# Altium schematic sheet TopLevel.SchDoc: Top Level Hierarchy
size 279 x 215 mm; DrawnBy: Connor Dack; DocumentNumber: 3; Revision: 1.0; SheetNumber: 3; SheetTotal: 20
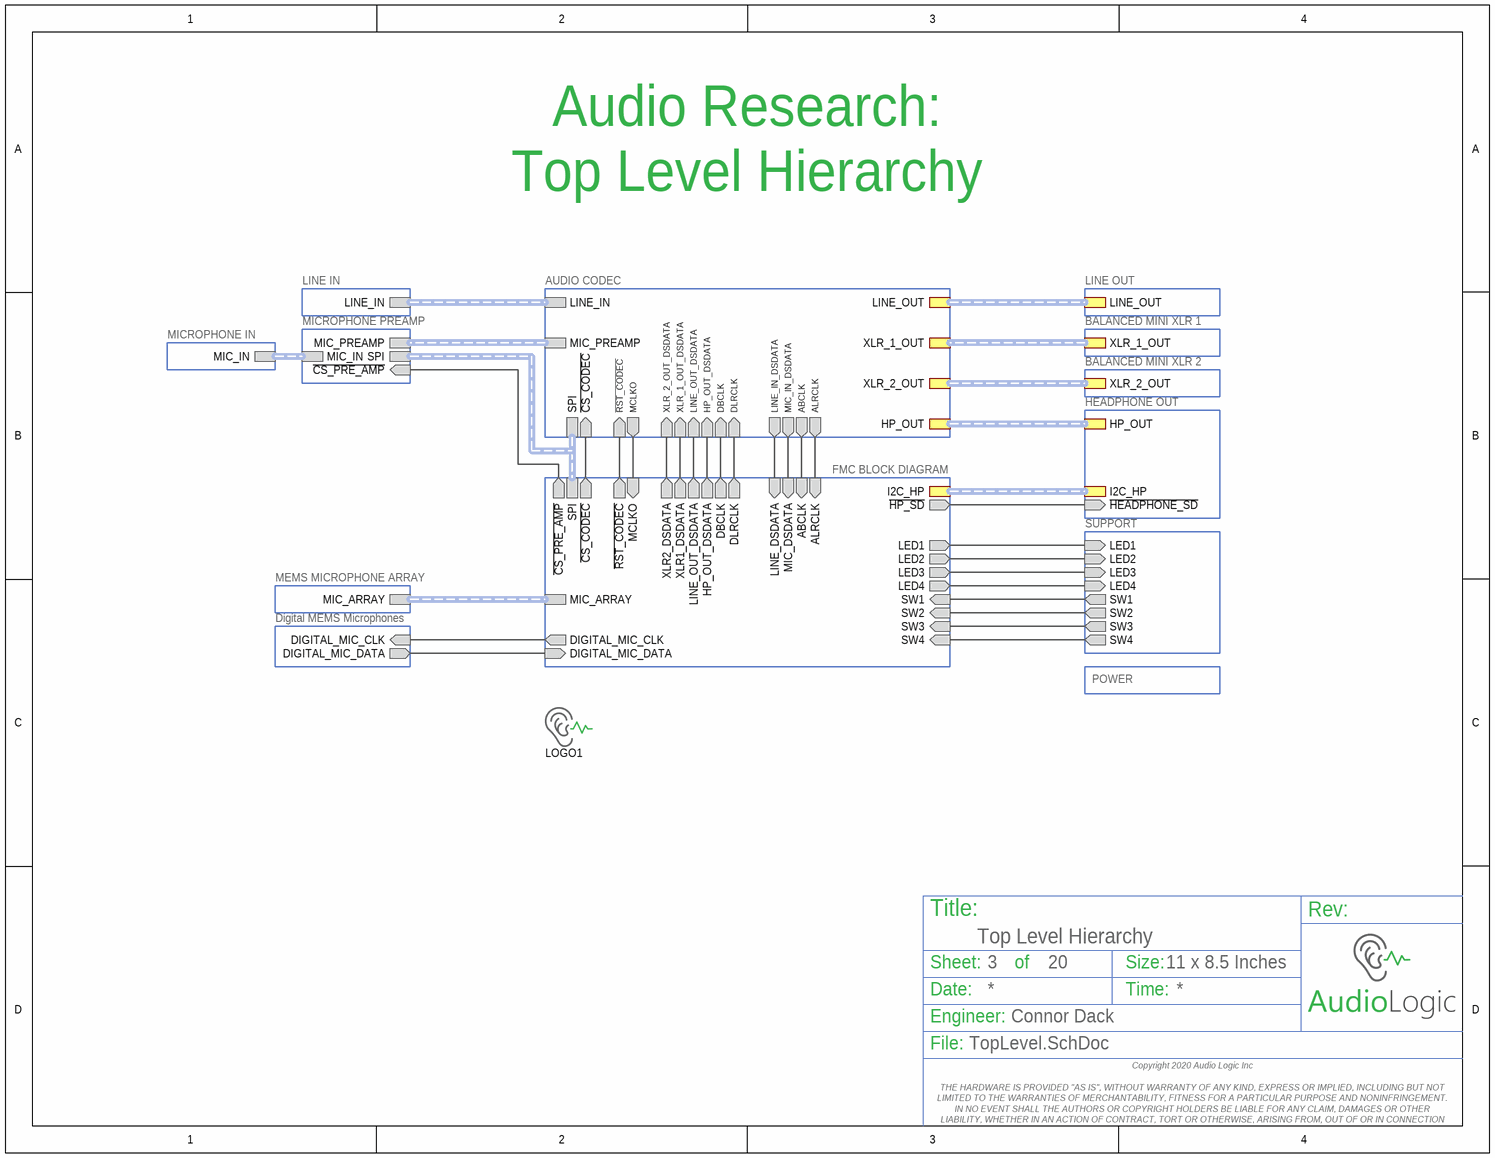
[diagram p0: TopLevel.SchDoc]

## Parts
LOGO1  Audio Logic Logo  [AL_Logo_Small_Silkscreen]  (value not drawn)  (no BOM)

## Sub-sheets
AUDIO CODEC = Audio_Codec.SchDoc: MIC_IN_DSDATA (out), ABCLK (out), ALRCLK (out), DBCLK (in), DLRCLK (in), MCLKO (out), ~{RST_CODEC} (in), HP_OUT_DSDATA (in), LINE_IN (harness LINE_IN), HP_OUT (harness HP_OUT), XLR_1_OUT_DSDATA (in), LINE_IN_DSDATA (out), LINE_OUT_DSDATA (in), XLR_2_OUT_DSDATA (in), LINE_OUT (harness LINE_OUT), MIC_PREAMP (harness MIC_PREAMP), XLR_1_OUT (harness XLR_1_OUT), SPI (harness SPI), ~{CS_CODEC} (in), XLR_2_OUT (harness XLR_2_OUT)
BALANCED MINI XLR 1 = Audio_Output_XLR1.SchDoc: XLR_1_OUT (harness MIC_IN)
BALANCED MINI XLR 2 = Audio_Output_XLR2.SchDoc: XLR_2_OUT (harness XLR_2_OUT)
Digital MEMS Microphones = Audio_Input_Digitial_Mic.SchDoc: DIGITAL_MIC_CLK (in), DIGITAL_MIC_DATA (out)
FMC BLOCK DIAGRAM = FMC_Block_Diagram.SchDoc: DIGITAL_MIC_CLK (out), DIGITAL_MIC_DATA (in), MIC_ARRAY (harness Microphone Array), LED1 (out), LED2 (out), LED3 (out), LED4 (out), SW1 (in), SW2 (in), SW3 (in), SW4 (in), ~{HP_SD} (out), ~{CS_PRE_AMP} (out), ~{CS_CODEC} (out), ~{RST_CODEC} (out), XLR2_DSDATA (out), DBCLK (out), DLRCLK (out), LINE_DSDATA (in), MIC_DSDATA (in), ABCLK (in), ALRCLK (in), XLR1_DSDATA (out), LINE_OUT_DSDATA (out), HP_OUT_DSDATA (out), SPI (harness SPI), I2C_HP (harness I2C_Headphone), MCLKO (in)
HEADPHONE OUT = Audio_Output_Headphone.SchDoc: HP_OUT (harness HP_OUT), ~{HEADPHONE_SD} (in), I2C_HP (harness I2C_Headphone)
LINE IN = Audio_Input_Line_In.SchDoc: LINE_IN (harness MIC_IN)
LINE OUT = Audio_Output_Line_Out.SchDoc: LINE_OUT (harness MIC_IN)
MEMS MICROPHONE ARRAY = Audio_Input_Mic_Array.SchDoc: MIC_ARRAY (harness Microphone Array)
MICROPHONE IN = Audio_Input_Mic_In.SchDoc: MIC_IN (harness MIC_IN)
MICROPHONE PREAMP = Audio_Input_Mic_Preamp.SchDoc: MIC_PREAMP (harness MIC_PREAMP), SPI (harness SPI), ~{CS_PRE_AMP} (in), MIC_IN (harness MIC_IN)
POWER = Power.SchDoc: no entries
SUPPORT = Support.SchDoc: SW1 (out), SW2 (out), SW3 (out), SW4 (out), LED1 (in), LED2 (in), LED3 (in), LED4 (in)

## Nets
(unnamed): sheet AUDIO CODEC/MIC_IN_DSDATA, sheet FMC BLOCK DIAGRAM/MIC_DSDATA
(unnamed): sheet AUDIO CODEC/ABCLK, sheet FMC BLOCK DIAGRAM/ABCLK
(unnamed): sheet AUDIO CODEC/ALRCLK, sheet FMC BLOCK DIAGRAM/ALRCLK
(unnamed): sheet AUDIO CODEC/DBCLK, sheet FMC BLOCK DIAGRAM/DBCLK
(unnamed): sheet AUDIO CODEC/DLRCLK, sheet FMC BLOCK DIAGRAM/DLRCLK
(unnamed): sheet AUDIO CODEC/MCLKO, sheet FMC BLOCK DIAGRAM/MCLKO
(unnamed): sheet AUDIO CODEC/~{RST_CODEC}, sheet FMC BLOCK DIAGRAM/~{RST_CODEC}
(unnamed): sheet AUDIO CODEC/HP_OUT_DSDATA, sheet FMC BLOCK DIAGRAM/HP_OUT_DSDATA
(unnamed): sheet AUDIO CODEC/XLR_1_OUT_DSDATA, sheet FMC BLOCK DIAGRAM/XLR1_DSDATA
(unnamed): sheet AUDIO CODEC/LINE_IN_DSDATA, sheet FMC BLOCK DIAGRAM/LINE_DSDATA
(unnamed): sheet AUDIO CODEC/LINE_OUT_DSDATA, sheet FMC BLOCK DIAGRAM/LINE_OUT_DSDATA
(unnamed): sheet AUDIO CODEC/XLR_2_OUT_DSDATA, sheet FMC BLOCK DIAGRAM/XLR2_DSDATA
(unnamed): sheet AUDIO CODEC/~{CS_CODEC}, sheet FMC BLOCK DIAGRAM/~{CS_CODEC}
(unnamed): sheet HEADPHONE OUT/~{HEADPHONE_SD}, sheet FMC BLOCK DIAGRAM/~{HP_SD}
(unnamed): sheet SUPPORT/SW1, sheet FMC BLOCK DIAGRAM/SW1
(unnamed): sheet SUPPORT/SW2, sheet FMC BLOCK DIAGRAM/SW2
(unnamed): sheet SUPPORT/SW3, sheet FMC BLOCK DIAGRAM/SW3
(unnamed): sheet SUPPORT/SW4, sheet FMC BLOCK DIAGRAM/SW4
(unnamed): sheet SUPPORT/LED1, sheet FMC BLOCK DIAGRAM/LED1
(unnamed): sheet SUPPORT/LED2, sheet FMC BLOCK DIAGRAM/LED2
(unnamed): sheet SUPPORT/LED3, sheet FMC BLOCK DIAGRAM/LED3
(unnamed): sheet SUPPORT/LED4, sheet FMC BLOCK DIAGRAM/LED4
(unnamed): sheet MICROPHONE PREAMP/~{CS_PRE_AMP}, sheet FMC BLOCK DIAGRAM/~{CS_PRE_AMP}
(unnamed): sheet Digital MEMS Microphones/DIGITAL_MIC_CLK, sheet FMC BLOCK DIAGRAM/DIGITAL_MIC_CLK
(unnamed): sheet Digital MEMS Microphones/DIGITAL_MIC_DATA, sheet FMC BLOCK DIAGRAM/DIGITAL_MIC_DATA

## Buses and harness runs
harness sheet AUDIO CODEC/HP_OUT = sheet HEADPHONE OUT/HP_OUT
harness sheet AUDIO CODEC/LINE_IN = sheet LINE IN/LINE_IN
harness sheet AUDIO CODEC/LINE_OUT = sheet LINE OUT/LINE_OUT
harness sheet AUDIO CODEC/MIC_PREAMP = sheet MICROPHONE PREAMP/MIC_PREAMP
harness sheet AUDIO CODEC/SPI = sheet FMC BLOCK DIAGRAM/SPI = sheet MICROPHONE PREAMP/SPI
harness sheet AUDIO CODEC/XLR_1_OUT = sheet BALANCED MINI XLR 1/XLR_1_OUT
harness sheet AUDIO CODEC/XLR_2_OUT = sheet BALANCED MINI XLR 2/XLR_2_OUT
harness sheet FMC BLOCK DIAGRAM/I2C_HP = sheet HEADPHONE OUT/I2C_HP
harness sheet FMC BLOCK DIAGRAM/MIC_ARRAY = sheet MEMS MICROPHONE ARRAY/MIC_ARRAY
harness sheet MICROPHONE IN/MIC_IN = sheet MICROPHONE PREAMP/MIC_IN

## Notes on the sheet
- Audio Research:
  Top Level Hierarchy
- Title:
- Sheet:
- of
- Size:
- 11 x 8.5 Inches
- Rev:
- Date:
- Engineer:
- Time:
- File:
- Copyright 2020 Audio Logic Inc
  THE HARDWARE IS PROVIDED "AS IS", WITHOUT WARRANTY OF ANY KIND, EXPRESS OR IMPLIED, INCLUDING BUT NOT LIMITED TO THE WARRANTIES OF MERCHANTABILITY, FITNESS FOR A PARTICULAR PURPOSE AND NONINFRINGEMENT. IN NO EVENT SHALL THE AUTHORS OR COPYRIGHT HOLDERS BE LIABLE FOR ANY CLAIM, DAMAGES OR OTHER LIABILITY, WHETHER IN AN ACTION OF CONTRACT, TORT OR OTHERWISE, ARISING FROM, OUT OF OR IN CONNECTION WITH THE HARDWARE OR THE USE OR OTHER DEALINGS IN THE HARDWARE.

## Library data of the parts
LOGO1 = Audio_Logic_Logo